# Altium schematic sheet Sheet1.SchDoc
size A; SheetNumber: 1; SheetTotal: 1
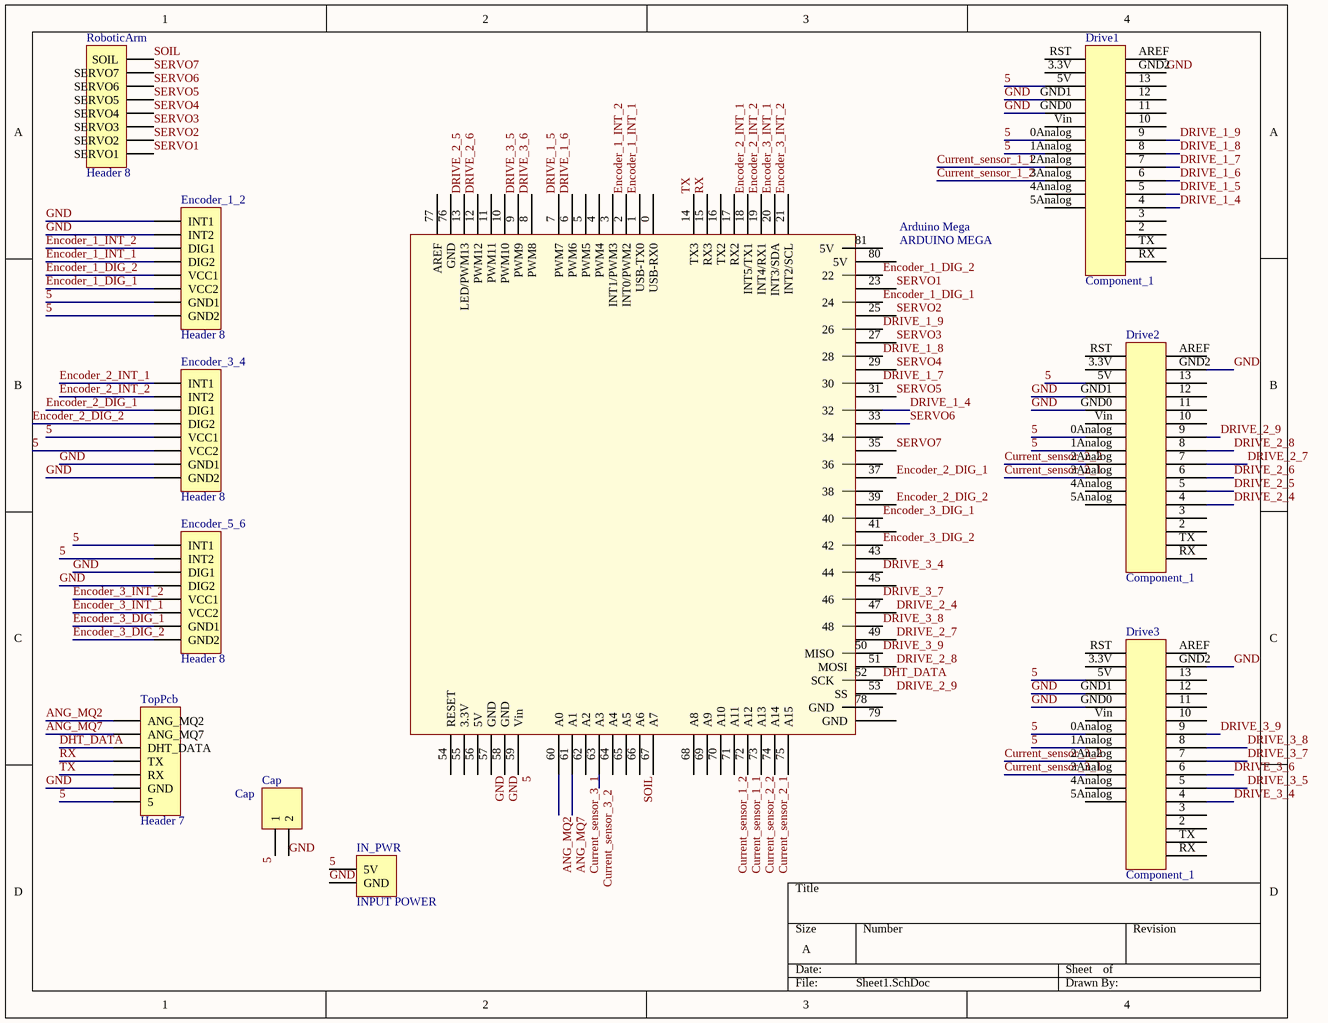
[diagram p0: Sheet1.SchDoc]

## Parts
Arduino_Mega  ARDUINO MEGA  [ARDUINO MEGA]
Cap  Cap  [HDR1X2]
Drive1  Component_1  [PCBComponent_1]
Drive2  Component_1  [PCBComponent_1]
Drive3  Component_1  [PCBComponent_1]
Encoder_1_2  Header 8  [HDR1X8]
Encoder_3_4  Header 8  [HDR1X8]
Encoder_5_6  Header 8  [HDR1X8]
IN_PWR  INPUT POWER  [HDR1X2]
RoboticArm  Header 8  [HDR1X8]
TopPcb  Header 7  [HDR1X7]

## Nets
5: Arduino_Mega.59(Vin) Cap.1 Drive1.0Analog Drive1.1Analog Drive1.5V Drive2.0Analog Drive2.1Analog Drive2.5V Drive3.0Analog Drive3.1Analog Drive3.5V Encoder_1_2.7(GND1) Encoder_1_2.8(GND2) Encoder_3_4.5(VCC1) Encoder_3_4.6(VCC2) Encoder_5_6.1(INT1) Encoder_5_6.2(INT2) IN_PWR.1(5V) TopPcb.7(5)
ANG_MQ2: Arduino_Mega.60(A0) TopPcb.1(ANG_MQ2)
ANG_MQ7: Arduino_Mega.61(A1) TopPcb.2(ANG_MQ7)
Current_sensor_1_1: Arduino_Mega.72(A12) Drive1.2Analog
Current_sensor_1_2: Arduino_Mega.71(A11) Drive1.3Analog
Current_sensor_2_1: Arduino_Mega.74(A14) Drive2.3Analog
Current_sensor_2_2: Arduino_Mega.73(A13) Drive2.2Analog
Current_sensor_3_1: Arduino_Mega.62(A2) Drive3.3Analog
Current_sensor_3_2: Arduino_Mega.63(A3) Drive3.2Analog
DHT_DATA: Arduino_Mega.52(SCK) TopPcb.3(DHT_DATA)
DRIVE_1_4: Arduino_Mega.32 Drive1.4
DRIVE_1_5: Arduino_Mega.7(PWM7) Drive1.5
DRIVE_1_6: Arduino_Mega.6(PWM6) Drive1.6
DRIVE_1_7: Arduino_Mega.30 Drive1.7
DRIVE_1_8: Arduino_Mega.28 Drive1.8
DRIVE_1_9: Arduino_Mega.26 Drive1.9
DRIVE_2_4: Arduino_Mega.47 Drive2.4
DRIVE_2_5: Arduino_Mega.13(LED/PWM13) Drive2.5
DRIVE_2_6: Arduino_Mega.12(PWM12) Drive2.6
DRIVE_2_7: Arduino_Mega.49 Drive2.7
DRIVE_2_8: Arduino_Mega.51(MOSI) Drive2.8
DRIVE_2_9: Arduino_Mega.53(SS) Drive2.9
DRIVE_3_4: Arduino_Mega.44 Drive3.4
DRIVE_3_5: Arduino_Mega.9(PWM9) Drive3.5
DRIVE_3_6: Arduino_Mega.8(PWM8) Drive3.6
DRIVE_3_7: Arduino_Mega.46 Drive3.7
DRIVE_3_8: Arduino_Mega.48 Drive3.8
DRIVE_3_9: Arduino_Mega.50(MISO) Drive3.9
Encoder_1_DIG_1: Arduino_Mega.24 Encoder_1_2.6(VCC2)
Encoder_1_DIG_2: Arduino_Mega.22 Encoder_1_2.5(VCC1)
Encoder_1_INT_1: Arduino_Mega.1(USB-TX0) Encoder_1_2.4(DIG2)
Encoder_1_INT_2: Arduino_Mega.2(INT0/PWM2) Encoder_1_2.3(DIG1)
Encoder_2_DIG_1: Arduino_Mega.37 Encoder_3_4.3(DIG1)
Encoder_2_DIG_2: Arduino_Mega.39 Encoder_3_4.4(DIG2)
Encoder_2_INT_1: Arduino_Mega.18(INT5/TX1) Encoder_3_4.1(INT1)
Encoder_2_INT_2: Arduino_Mega.19(INT4/RX1) Encoder_3_4.2(INT2)
Encoder_3_DIG_1: Arduino_Mega.40 Encoder_5_6.7(GND1)
Encoder_3_DIG_2: Arduino_Mega.42 Encoder_5_6.8(GND2)
Encoder_3_INT_1: Arduino_Mega.20(INT3/SDA) Encoder_5_6.6(VCC2)
Encoder_3_INT_2: Arduino_Mega.21(INT2/SCL) Encoder_5_6.5(VCC1)
GND: Arduino_Mega.57(GND) Arduino_Mega.58(GND) Cap.2 Drive1.GND0 Drive1.GND1 Drive1.GND2 Drive2.GND0 Drive2.GND1 Drive2.GND2 Drive3.GND0 Drive3.GND1 Drive3.GND2 Encoder_1_2.1(INT1) Encoder_1_2.2(INT2) Encoder_3_4.7(GND1) Encoder_3_4.8(GND2) Encoder_5_6.3(DIG1) Encoder_5_6.4(DIG2) IN_PWR.2(GND) TopPcb.6(GND)
RX: Arduino_Mega.15(RX3) TopPcb.4(TX)
SERVO1: Arduino_Mega.23 RoboticArm.1(SERVO1)
SERVO2: Arduino_Mega.25 RoboticArm.2(SERVO2)
SERVO3: Arduino_Mega.27 RoboticArm.3(SERVO3)
SERVO4: Arduino_Mega.29 RoboticArm.4(SERVO4)
SERVO5: Arduino_Mega.31 RoboticArm.5(SERVO5)
SERVO6: Arduino_Mega.33 RoboticArm.6(SERVO6)
SERVO7: Arduino_Mega.35 RoboticArm.7(SERVO7)
SOIL: Arduino_Mega.66(A6) RoboticArm.8(SOIL)
TX: Arduino_Mega.14(TX3) TopPcb.5(RX)

Not connected (* = marked no-connect by the designer): Arduino_Mega 0(USB-RX0) 3(INT1/PWM3) 4(PWM4) 5(PWM5) 10(PWM10) 11(PWM11) 16(TX2) 17(RX2) 34 36 38 41 43 45 54(RESET) 55(3.3V) 56(5V) 64(A4) 65(A5) 67(A7) 68(A8) 69(A9) 70(A10) 75(A15) 76(GND) 77(AREF) 78(GND) 79(GND) 80(5V) 81(5V); Drive1 2 3 3.3V 4Analog 5Analog 10 11 12 13 AREF RST RX TX Vin; Drive2 2 3 3.3V 4Analog 5Analog 10 11 12 13 AREF RST RX TX Vin; Drive3 2 3 3.3V 4Analog 5Analog 10 11 12 13 AREF RST RX TX Vin

## Library data of the parts
Cap IN_PWR = Header 2: Header, 2-Pin; LatestRevisionDate: 17-Jul-2002; LatestRevisionNote: Re-released for DXP Platform.; Publisher: Altium Limited
Encoder_1_2 Encoder_3_4 Encoder_5_6 RoboticArm = Header 8: Header, 8-Pin; LatestRevisionDate: 17-Jul-2002; LatestRevisionNote: Re-released for DXP Platform.; Publisher: Altium Limited
TopPcb = Header 7: Header, 7-Pin; LatestRevisionDate: 17-Jul-2002; LatestRevisionNote: Re-released for DXP Platform.; Publisher: Altium Limited